# Altium schematic sheet RSD_M1_LED_TURN_RIGHT_V2.SchDoc
size A4
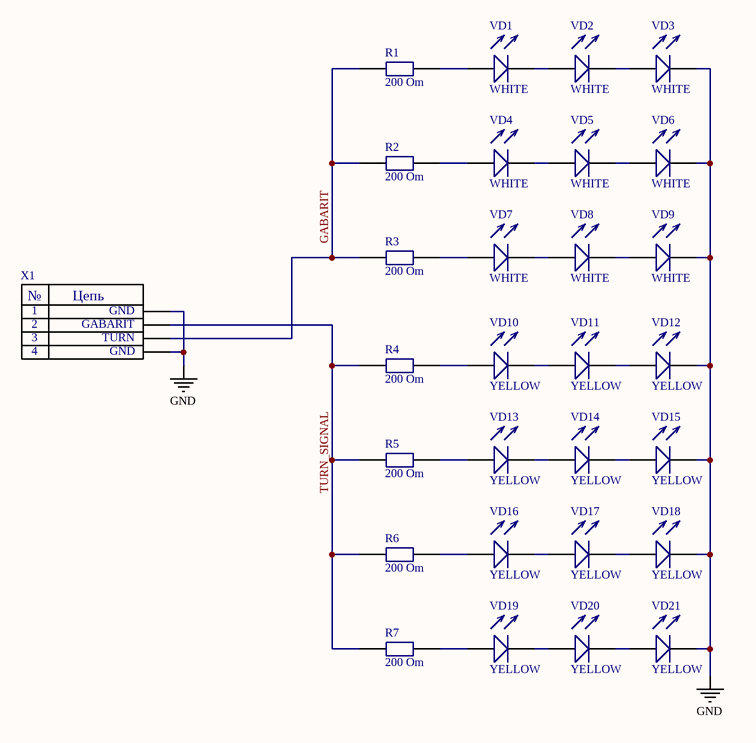
[diagram p0: RSD_M1_LED_TURN_RIGHT_V2.SchDoc]

## Parts
R1  value 200 Om  [Res0603]  (hidden comment: Resistor)
R2  value 200 Om  [Res0603]  (hidden comment: Resistor)
R3  value 200 Om  [Res0603]  (hidden comment: Resistor)
R4  value 200 Om  [Res0603]  (hidden comment: Resistor)
R5  value 200 Om  [Res0603]  (hidden comment: Resistor)
R6  value 200 Om  [Res0603]  (hidden comment: Resistor)
R7  value 200 Om  [Res0603]  (hidden comment: Resistor)
VD1  value WHITE  [3528_LED]  (hidden comment: LED)
VD2  value WHITE  [3528_LED]  (hidden comment: LED)
VD3  value WHITE  [3528_LED]  (hidden comment: LED)
VD4  value WHITE  [3528_LED]  (hidden comment: LED)
VD5  value WHITE  [3528_LED]  (hidden comment: LED)
VD6  value WHITE  [3528_LED]  (hidden comment: LED)
VD7  value WHITE  [3528_LED]  (hidden comment: LED)
VD8  value WHITE  [3528_LED]  (hidden comment: LED)
VD9  value WHITE  [3528_LED]  (hidden comment: LED)
VD10  value YELLOW  [3528_LED]  (hidden comment: LED)
VD11  value YELLOW  [3528_LED]  (hidden comment: LED)
VD12  value YELLOW  [3528_LED]  (hidden comment: LED)
VD13  value YELLOW  [3528_LED]  (hidden comment: LED)
VD14  value YELLOW  [3528_LED]  (hidden comment: LED)
VD15  value YELLOW  [3528_LED]  (hidden comment: LED)
VD16  value YELLOW  [3528_LED]  (hidden comment: LED)
VD17  value YELLOW  [3528_LED]  (hidden comment: LED)
VD18  value YELLOW  [3528_LED]  (hidden comment: LED)
VD19  value YELLOW  [3528_LED]  (hidden comment: LED)
VD20  value YELLOW  [3528_LED]  (hidden comment: LED)
VD21  value YELLOW  [3528_LED]  (hidden comment: LED)
X1  1: GND  2: GABARIT  3: TURN  [FPC_4_1]  (hidden comment: FPC_connector_4_1)

## Nets
GND: VD3.1 VD6.1 VD9.1 VD12.1 VD15.1 VD18.1 VD21.1 X1.1 X1.4
GABARIT: R1.2 R2.2 R3.2 X1.3
TURN_SIGNAL: R4.2 R5.2 R6.2 R7.2 X1.2
NetR1_1: R1.1 VD1.2
NetR2_1: R2.1 VD4.2
NetR3_1: R3.1 VD7.2
NetR4_1: R4.1 VD10.2
NetR5_1: R5.1 VD13.2
NetR6_1: R6.1 VD16.2
NetR7_1: R7.1 VD19.2
NetVD1_1: VD1.1 VD2.2
NetVD2_1: VD2.1 VD3.2
NetVD4_1: VD4.1 VD5.2
NetVD5_1: VD5.1 VD6.2
NetVD7_1: VD7.1 VD8.2
NetVD8_1: VD8.1 VD9.2
NetVD10_1: VD10.1 VD11.2
NetVD11_1: VD11.1 VD12.2
NetVD13_1: VD13.1 VD14.2
NetVD14_1: VD14.1 VD15.2
NetVD16_1: VD16.1 VD17.2
NetVD17_1: VD17.1 VD18.2
NetVD19_1: VD19.1 VD20.2
NetVD20_1: VD20.1 VD21.2

## Notes on the sheet
- (in symbol FPC_connector_4_1) №; Цепь

## Library data of the parts
X1 = FPC_connector_4_1: Value: 0522070433; 4: GND